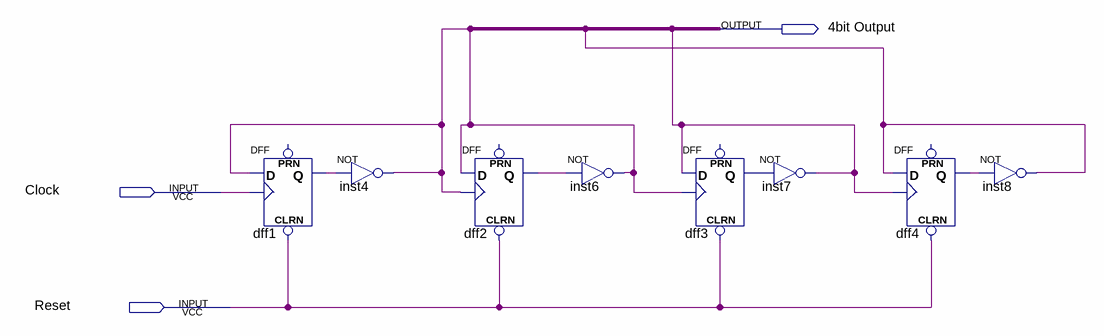
[diagram p0: schematic sheet]
// Quartus schematic Ripple Down schematic.bdf as structural Verilog: 8 symbols, 3 pins
module \Ripple_Down_schematic  (
  input  Clock,
  input  Reset,
  output \4bit_Output 
);

  wire dff1_q, dff2_q, dff3_q, dff4_q;

  DFF dff1 (.CLRN(Reset), .CLK(Clock), .D(\4bit_Output ), .Q(dff1_q));  // open: PRN
  not inst4 (\4bit_Output , dff1_q);
  DFF dff2 (.CLRN(Reset), .CLK(\4bit_Output ), .D(\4bit_Output ), .Q(dff2_q));  // open: PRN
  not inst6 (\4bit_Output , dff2_q);
  DFF dff3 (.CLRN(Reset), .CLK(\4bit_Output ), .D(\4bit_Output ), .Q(dff3_q));  // open: PRN
  not inst7 (\4bit_Output , dff3_q);
  DFF dff4 (.CLRN(Reset), .CLK(\4bit_Output ), .D(\4bit_Output ), .Q(dff4_q));  // open: PRN
  not inst8 (\4bit_Output , dff4_q);
endmodule
